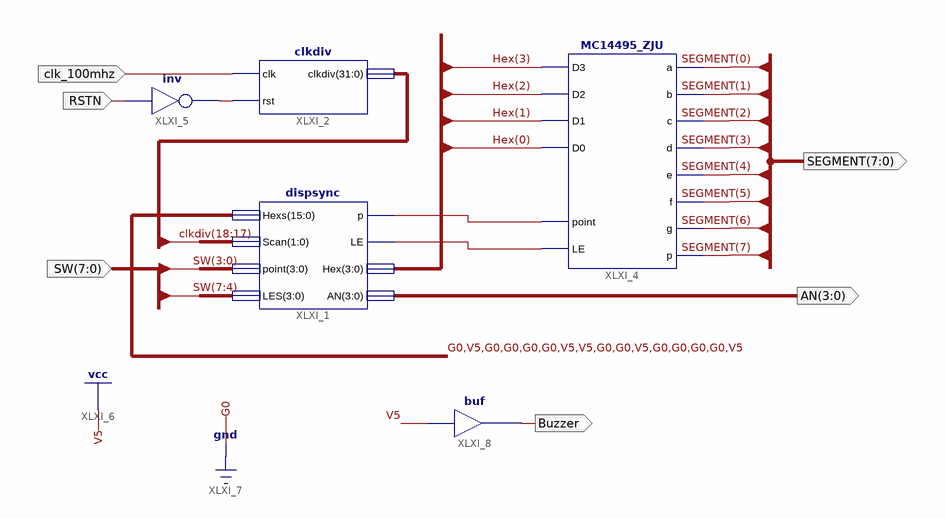
[diagram p0: schematic sheet 1]
// Xilinx ISE schematic Hex427Seg_sch.sch (kintex7) as structural Verilog: 5 symbols, 6 ports
module Hex427Seg_sch (
  input  [7:0] SW,
  input  clk_100mhz,
  input  RSTN,
  output [3:0] AN,
  output [7:0] SEGMENT,
  output Buzzer
);

  wire XLXN_3, XLXN_4, XLXN_31;
  wire [3:0] Hex;
  wire [31:0] clkdiv;

  dispsync XLXI_1 (
    .Hexs(16'b0100001100100001), .Scan(clkdiv[18:17]), .point(SW[3:0]), .LES(SW[7:4]), .p(XLXN_4),
    .LE(XLXN_3), .Hex(Hex), .AN(AN));
  clkdiv XLXI_2 (.clk(clk_100mhz), .rst(XLXN_31), .clkdiv(clkdiv));
  MC14495_ZJU XLXI_4 (
    .a(SEGMENT[0]), .b(SEGMENT[1]), .c(SEGMENT[2]), .d(SEGMENT[3]), .D0(Hex[0]), .D1(Hex[1]), .D2(Hex[2]),
    .D3(Hex[3]), .e(SEGMENT[4]), .f(SEGMENT[5]), .g(SEGMENT[6]), .p(SEGMENT[7]), .LE(XLXN_3), .point(XLXN_4));
  not XLXI_5 (XLXN_31, RSTN);
  buf XLXI_8 (Buzzer, 1'b1);
endmodule
